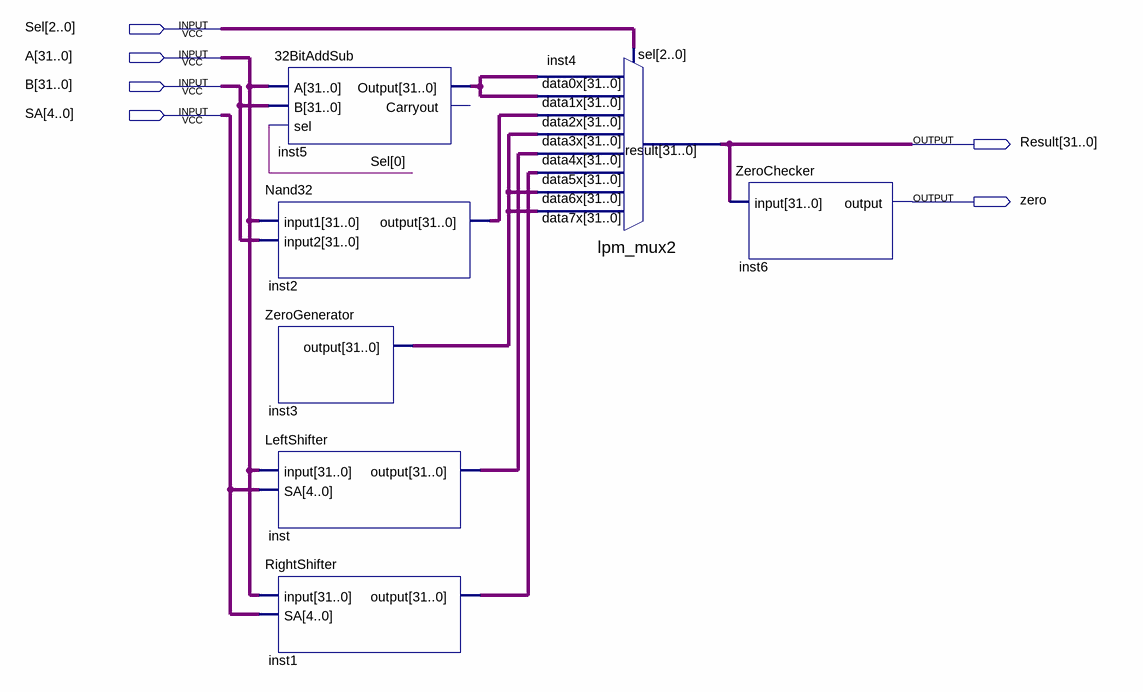
[diagram p0: schematic sheet]
// Quartus schematic ALU.bdf as structural Verilog: 7 symbols, 6 pins
module ALU (
  input  [2:0] Sel,
  input  [31:0] A,
  input  [31:0] B,
  input  [4:0] SA,
  output [31:0] Result,
  output zero
);

  wire [31:0] inst1_output, inst2_output, inst3_output, inst5_output, inst_output;

  Nand32 inst2 (.input1(A), .input2(B), .\output (inst2_output));
  ZeroGenerator inst3 (.\output (inst3_output));
  LeftShifter inst (.\input (A), .SA(SA), .\output (inst_output));
  RightShifter inst1 (.\input (A), .SA(SA), .\output (inst1_output));
  \32BitAddSub  inst5 (.A(A), .B(B), .sel(Sel[0]), .Output(inst5_output));  // open: Carryout
  lpm_mux2 inst4 (
    .data7x(inst3_output), .data6x(inst3_output), .data5x(inst1_output), .data4x(inst_output),
    .data3x(inst3_output), .data2x(inst2_output), .data1x(inst5_output), .data0x(inst5_output), .sel(Sel),
    .result(Result));
  ZeroChecker inst6 (.\input (Result), .\output (zero));
endmodule
